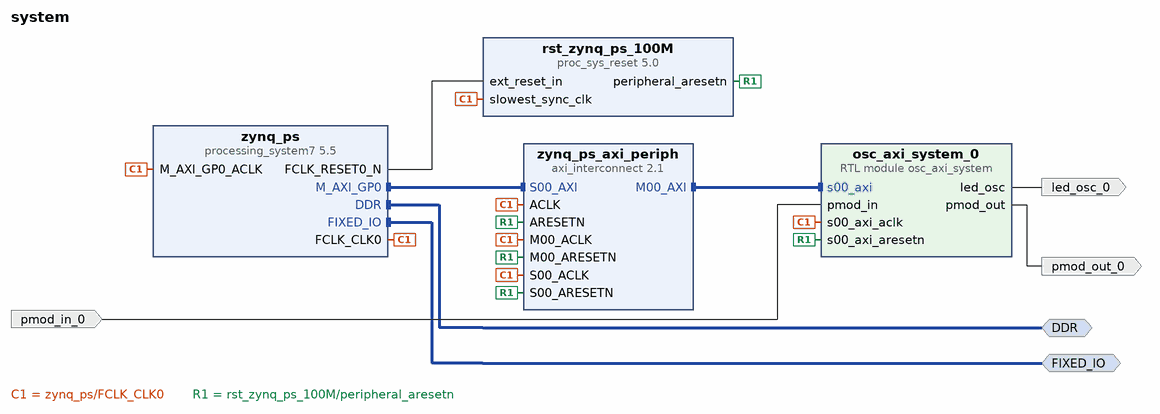
[diagram p0: block diagram of the top level]
# Vivado block design system, xc7z020clg484-1, Vivado 2018.3
create_bd_design system

create_bd_intf_port -mode Master -vlnv xilinx.com:interface:ddrx_rtl:1.0 DDR
create_bd_intf_port -mode Master -vlnv xilinx.com:display_processing_system7:fixedio_rtl:1.0 FIXED_IO
create_bd_port -dir O led_osc_0
create_bd_port -dir I pmod_in_0
create_bd_port -dir O pmod_out_0

create_bd_cell -type ip -vlnv xilinx.com:ip:processing_system7:5.5 zynq_ps
set_property -dict [list \
  CONFIG.PCW_APU_PERIPHERAL_FREQMHZ 666.666667 \
  CONFIG.PCW_ENET0_ENET0_IO {MIO 16 .. 27} \
  CONFIG.PCW_ENET0_GRP_MDIO_ENABLE 1 \
  CONFIG.PCW_ENET0_GRP_MDIO_IO {MIO 52 .. 53} \
  CONFIG.PCW_ENET0_PERIPHERAL_ENABLE 1 \
  CONFIG.PCW_ENET0_RESET_ENABLE 0 \
  CONFIG.PCW_ENET_RESET_ENABLE 1 \
  CONFIG.PCW_ENET_RESET_SELECT {Share reset pin} \
  CONFIG.PCW_FPGA0_PERIPHERAL_FREQMHZ 100.000000 \
  CONFIG.PCW_FPGA1_PERIPHERAL_FREQMHZ 150.000000 \
  CONFIG.PCW_FPGA2_PERIPHERAL_FREQMHZ 50.000000 \
  CONFIG.PCW_GPIO_MIO_GPIO_ENABLE 1 \
  CONFIG.PCW_GPIO_MIO_GPIO_IO MIO \
  CONFIG.PCW_I2C_RESET_ENABLE 1 \
  CONFIG.PCW_PRESET_BANK1_VOLTAGE {LVCMOS 1.8V} \
  CONFIG.PCW_QSPI_GRP_SINGLE_SS_ENABLE 1 \
  CONFIG.PCW_QSPI_GRP_SINGLE_SS_IO {MIO 1 .. 6} \
  CONFIG.PCW_QSPI_PERIPHERAL_ENABLE 1 \
  CONFIG.PCW_QSPI_PERIPHERAL_FREQMHZ 200.000000 \
  CONFIG.PCW_QSPI_QSPI_IO {MIO 1 .. 6} \
  CONFIG.PCW_SD0_GRP_CD_ENABLE 1 \
  CONFIG.PCW_SD0_GRP_CD_IO {MIO 47} \
  CONFIG.PCW_SD0_GRP_WP_ENABLE 1 \
  CONFIG.PCW_SD0_GRP_WP_IO {MIO 46} \
  CONFIG.PCW_SD0_PERIPHERAL_ENABLE 1 \
  CONFIG.PCW_SD0_SD0_IO {MIO 40 .. 45} \
  CONFIG.PCW_SDIO_PERIPHERAL_FREQMHZ 50 \
  CONFIG.PCW_SINGLE_QSPI_DATA_MODE x4 \
  CONFIG.PCW_TTC0_PERIPHERAL_ENABLE 1 \
  CONFIG.PCW_TTC0_TTC0_IO EMIO \
  CONFIG.PCW_UART1_PERIPHERAL_ENABLE 1 \
  CONFIG.PCW_UART1_UART1_IO {MIO 48 .. 49} \
  CONFIG.PCW_UART_PERIPHERAL_FREQMHZ 50 \
  CONFIG.PCW_UIPARAM_DDR_FREQ_MHZ 533.333313 \
  CONFIG.PCW_UIPARAM_DDR_PARTNO {MT41J128M16 HA-15E} \
  CONFIG.PCW_USB0_PERIPHERAL_ENABLE 1 \
  CONFIG.PCW_USB0_RESET_ENABLE 0 \
  CONFIG.PCW_USB0_USB0_IO {MIO 28 .. 39} \
  CONFIG.PCW_USB_RESET_ENABLE 1 \
  CONFIG.PCW_USB_RESET_SELECT {Share reset pin} \
  CONFIG.preset ZedBoard \
] [get_bd_cells zynq_ps]
# 224 more settings of zynq_ps are not shown: defaults, MIO pin electricals, DDR timing, and values the tool derives
create_bd_cell -type ip -vlnv xilinx.com:ip:axi_interconnect:2.1 zynq_ps_axi_periph
set_property -dict {CONFIG.NUM_MI 1} [get_bd_cells zynq_ps_axi_periph]
create_bd_cell -type ip -vlnv xilinx.com:ip:proc_sys_reset:5.0 rst_zynq_ps_100M
create_bd_cell -type module -reference osc_axi_system osc_axi_system_0

# ---- connections ----

connect_bd_intf_net [get_bd_intf_pins zynq_ps_axi_periph/M00_AXI] [get_bd_intf_pins osc_axi_system_0/s00_axi]
connect_bd_intf_net [get_bd_intf_ports DDR] [get_bd_intf_pins zynq_ps/DDR]
connect_bd_intf_net [get_bd_intf_pins zynq_ps/M_AXI_GP0] [get_bd_intf_pins zynq_ps_axi_periph/S00_AXI]
connect_bd_intf_net [get_bd_intf_ports FIXED_IO] [get_bd_intf_pins zynq_ps/FIXED_IO]
connect_bd_net [get_bd_pins zynq_ps/FCLK_CLK0] \
  [get_bd_pins zynq_ps/M_AXI_GP0_ACLK] [get_bd_pins zynq_ps_axi_periph/S00_ACLK] \
  [get_bd_pins rst_zynq_ps_100M/slowest_sync_clk] [get_bd_pins zynq_ps_axi_periph/M00_ACLK] \
  [get_bd_pins zynq_ps_axi_periph/ACLK] [get_bd_pins osc_axi_system_0/s00_axi_aclk]
connect_bd_net [get_bd_pins zynq_ps/FCLK_RESET0_N] [get_bd_pins rst_zynq_ps_100M/ext_reset_in]
connect_bd_net [get_bd_pins rst_zynq_ps_100M/peripheral_aresetn] \
  [get_bd_pins zynq_ps_axi_periph/S00_ARESETN] [get_bd_pins zynq_ps_axi_periph/M00_ARESETN] \
  [get_bd_pins zynq_ps_axi_periph/ARESETN] [get_bd_pins osc_axi_system_0/s00_axi_aresetn]
connect_bd_net [get_bd_pins osc_axi_system_0/led_osc] [get_bd_ports led_osc_0]
connect_bd_net -net pmod_in_0_1 [get_bd_ports pmod_in_0] [get_bd_pins osc_axi_system_0/pmod_in]
connect_bd_net [get_bd_pins osc_axi_system_0/pmod_out] [get_bd_ports pmod_out_0]

# ---- address map ----
assign_bd_address -offset 0x43C00000 -range 64K -target_address_space [get_bd_addr_spaces zynq_ps/Data] [get_bd_addr_segs osc_axi_system_0/s00_axi/reg0]

validate_bd_design
save_bd_design
